# Altium schematic sheet ZX-XH2.54-2PZZ1_ZX-XH2.54-2PZZ.schdoc
size 124 x 99 mm
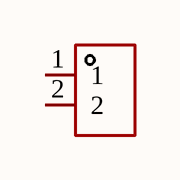
[diagram p0: ZX-XH2.54-2PZZ1_ZX-XH2.54-2PZZ.schdoc]

## Parts
CN?  ZX-XH2.54-2PZZ  [CONN-TH_2P-P2.50_HX25003-2A]  (value not drawn)

## Nets

Not connected (* = marked no-connect by the designer): CN? 1 2

## Library data of the parts
CN? = ZX-XH2.54-2PZZ: Manufacturer: Megastar(兆星); Add into BOM: yes; Pins Structure: 1x2P; Pitch: 2.5mm; Reference Series: XH; Number of PINs Per Row: 2; Current Rating: 3A; Voltage Rating: 250V; Plastic Material: PA66; Flame Retardant Rating: UL94V-0; Z-Height of the Board: 7mm; X-Length of Bottom Edge on Board (Spacing Line): 7.5mm; Y-Width of Bottom Edge on Board: 5.9mm; Symbol: ZX-XH2.54-2PZZ; Device: ZX-XH2.54-2PZZ; LCSC Part Name: 1x2P 间距:2.5mm 直插 系列:XH; Supplier Part: C7429632; Manufacturer Part: ZX-XH2.54-2PZZ; Supplier Footprint: 插件,P=2.5mm; JLCPCB Part Class: Extended Part; Datasheet: https://item.szlcsc.com/datasheet/ZX-XH2.54-2PZZ/8427549.html; Supplier: LCSC; Convert to PCB: yes; Mounting Type: 直插; Number of Pins: 2P; Number of Rows: 1; Row Spacing: -; Contact Material: 黄铜; Contact Plating: 锡; Operating Temperature: -25℃~+85℃; Supplementary Features: -; Color: 白色